# EAGLE board router (EAGLE 9.6.2), part 1 of 2
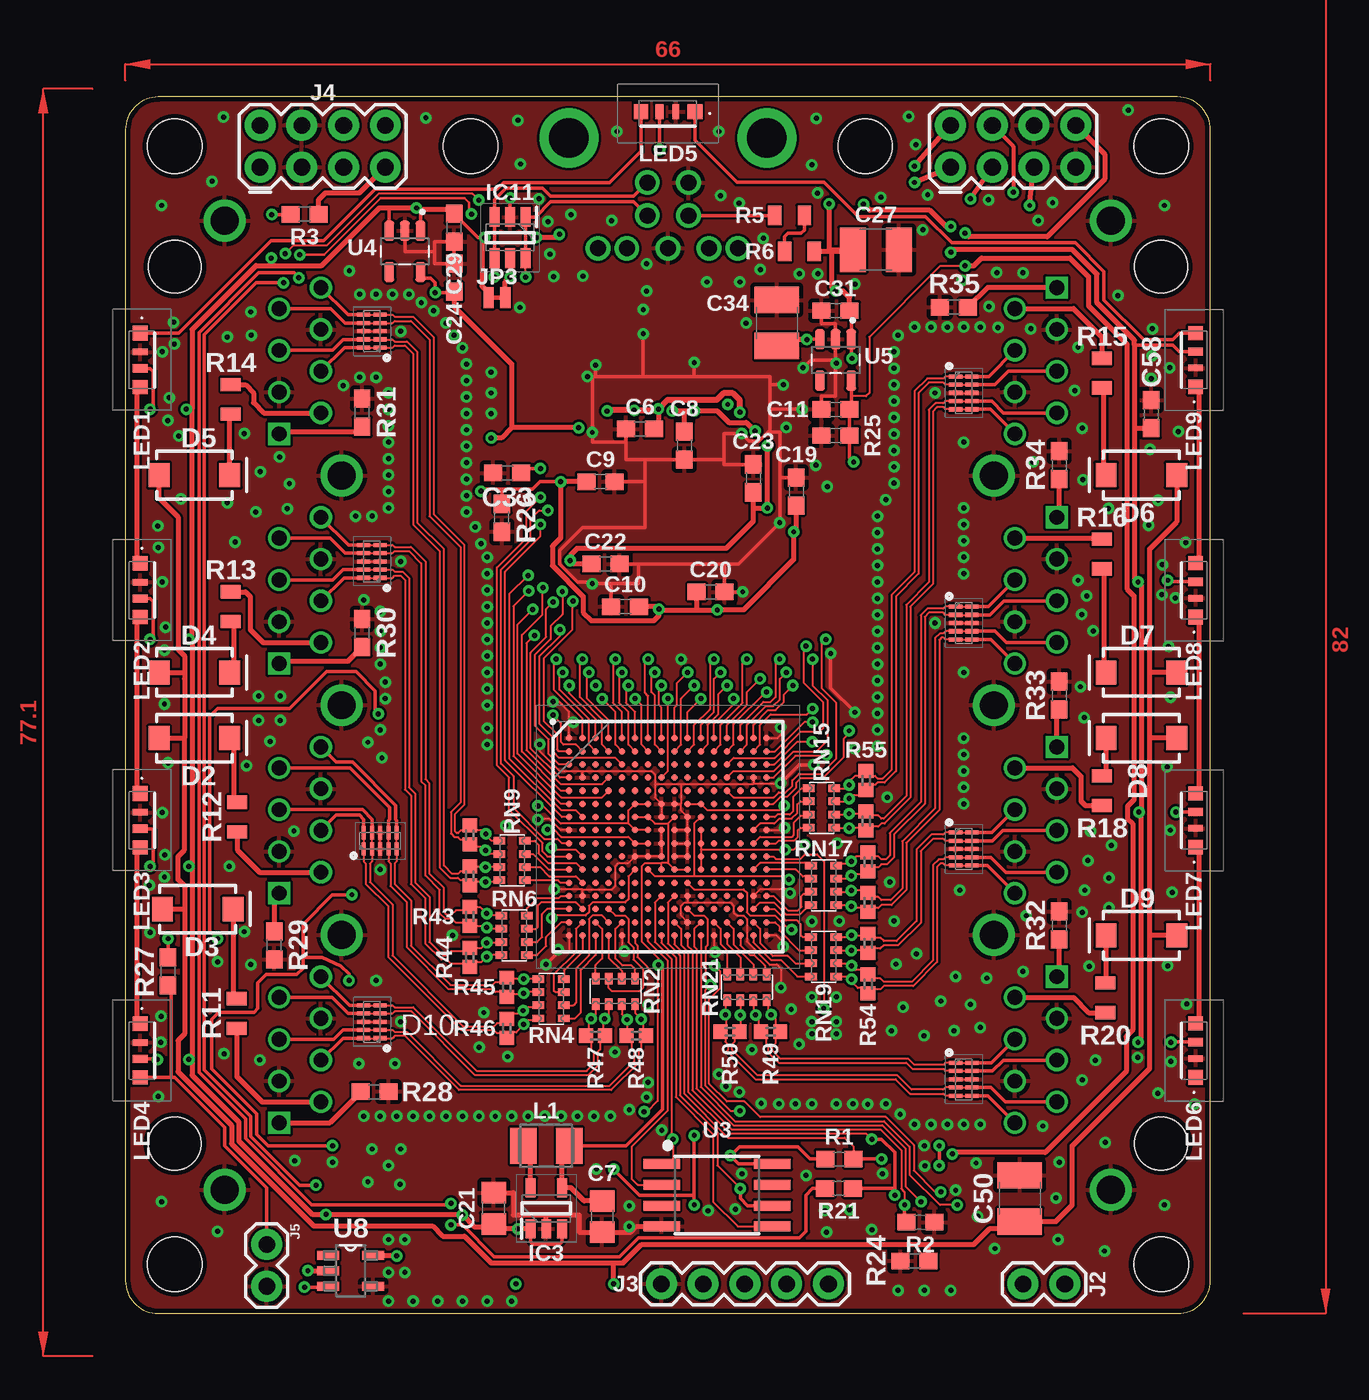
[diagram p3: board, top side]
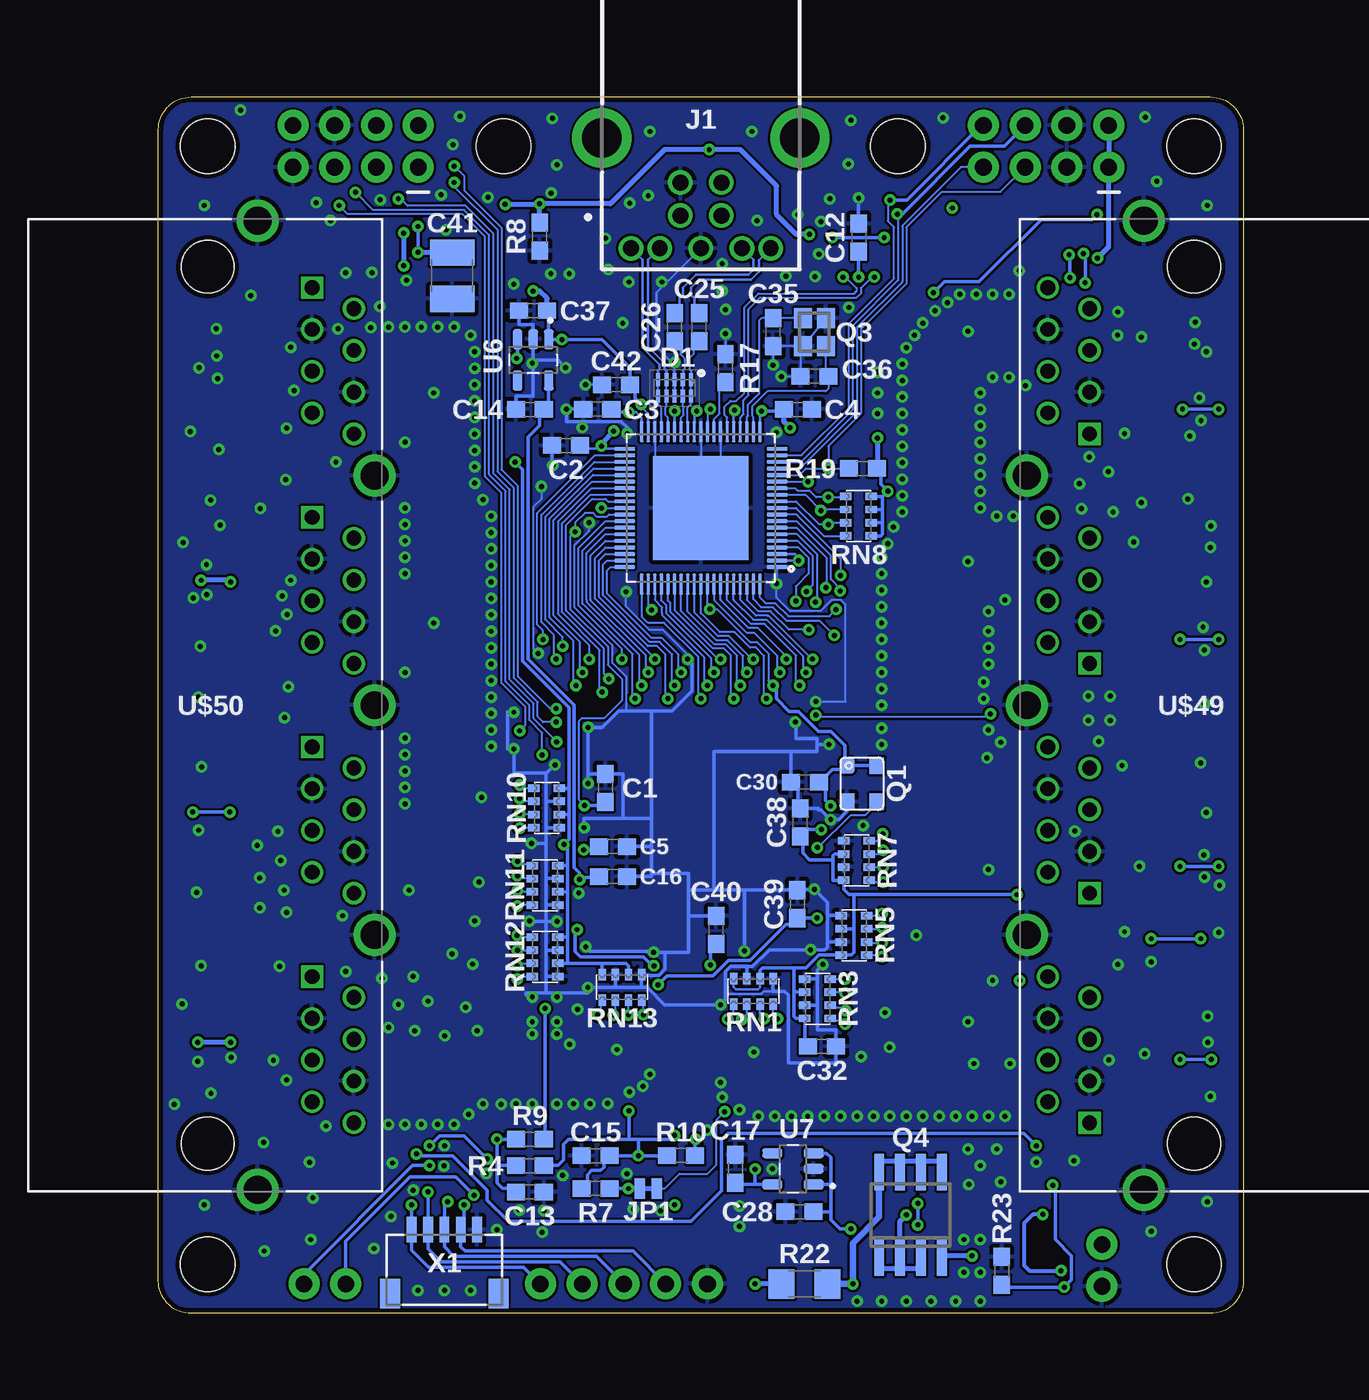
[diagram p4: board, bottom side, seen from below]

Size 66 x 74 mm. Coordinates in mm from the lower left corner, seen from the top.
Outline: 0,72 0,2 arc90 2,0 64,0 arc90 66,2 66,72 arc90 64,74 2,74 arc90 0,72
Copper layers (1*16): Top 0.035mm / dielectric 1.5mm / Bottom 0.035mm
Design rules "default *": minimum track width 0.125mm, minimum drill 0.3mm, track to track 0.125mm, track to pad 0.125mm, pad to pad 0.125mm, via to via 0.125mm, smd to smd 0mil, copper to edge 0.3mm, drill to drill 0.25mm, minimum pad ring 0.2mm, minimum via ring 0.2mm, stop-mask expansion 4mil, vias tented up to drill 4mm, thermal gap 10mil
Holes 3.3 mm at 3,71 63,71 63,3 3,3 45,71 21,71

## Footprints (pad centres in the part's own frame; a part is rotated, then mirrored left to right if it is on the bottom)
C0603 = smd 1.1 x 1: 1 -0.85,0; 2 0.85,0
0603 = smd 1.1 x 1: 1 -0.85,0; 2 0.85,0
C0805 = smd 1.3 x 1.5: 1 -0.95,0; 2 0.95,0
C1210 = smd 1.6 x 2.7: 1 -1.4,0; 2 1.4,0
SON50P100X250X80-10N = smd 0.8 x 0.25: 1 -0.5,1; 2 -0.5,0.5; 3 -0.5,0; 4 -0.5,-0.5; 5 -0.5,-1; 6 0.5,-1; 7 0.5,-0.5; 8 0.5,0; 9 0.5,0.5; 10 0.5,1
SMA-DIODE = smd 1.27 x 1.47: A -2.15,0; C 2.15,0
BGA256C80P16X16_1400X1400X170 = smd 0.41 x 0.41: A1 -6,6; A2 -5.2,6; A3 -4.4,6; A4 -3.6,6; A5 -2.8,6; A6 -2,6; A7 -1.2,6; A8 -0.4,6; A9 0.4,6; A10 1.2,6; A11 2,6; A12 2.8,6; A13 3.6,6; A14 4.4,6; A15 5.2,6; A16 6,6; B1 -6,5.2; B2 -5.2,5.2; B3 -4.4,5.2; B4 -3.6,5.2; B5 -2.8,5.2; B6 -2,5.2; B7 -1.2,5.2; B8 -0.4,5.2; B9 0.4,5.2; B10 1.2,5.2; B11 2,5.2; B12 2.8,5.2; B13 3.6,5.2; B14 4.4,5.2; B15 5.2,5.2; B16 6,5.2; C1 -6,4.4; C2 -5.2,4.4; C3 -4.4,4.4; C4 -3.6,4.4; C5 -2.8,4.4; C6 -2,4.4; C7 -1.2,4.4; C8 -0.4,4.4; C9 0.4,4.4; C10 1.2,4.4; C11 2,4.4; C12 2.8,4.4; C13 3.6,4.4; C14 4.4,4.4; C15 5.2,4.4; C16 6,4.4; D1 -6,3.6; D2 -5.2,3.6; D3 -4.4,3.6; D4 -3.6,3.6; D5 -2.8,3.6; D6 -2,3.6; D7 -1.2,3.6; D8 -0.4,3.6; D9 0.4,3.6; D10 1.2,3.6; D11 2,3.6; D12 2.8,3.6; D13 3.6,3.6; D14 4.4,3.6; D15 5.2,3.6; D16 6,3.6; E1 -6,2.8; E2 -5.2,2.8; E3 -4.4,2.8; E4 -3.6,2.8; E5 -2.8,2.8; E6 -2,2.8; E7 -1.2,2.8; E8 -0.4,2.8; E9 0.4,2.8; E10 1.2,2.8; E11 2,2.8; E12 2.8,2.8; E13 3.6,2.8; E14 4.4,2.8; E15 5.2,2.8; E16 6,2.8; F1 -6,2; F2 -5.2,2; F3 -4.4,2; F4 -3.6,2; F5 -2.8,2; F6 -2,2; F7 -1.2,2; F8 -0.4,2; F9 0.4,2; F10 1.2,2; F11 2,2; F12 2.8,2; F13 3.6,2; F14 4.4,2; F15 5.2,2; F16 6,2; G1 -6,1.2; G2 -5.2,1.2; G3 -4.4,1.2; G4 -3.6,1.2; G5 -2.8,1.2; G6 -2,1.2; G7 -1.2,1.2; G8 -0.4,1.2; G9 0.4,1.2; G10 1.2,1.2; G11 2,1.2; G12 2.8,1.2; G13 3.6,1.2; G14 4.4,1.2; G15 5.2,1.2; G16 6,1.2; H1 -6,0.4; H2 -5.2,0.4; H3 -4.4,0.4; H4 -3.6,0.4; H5 -2.8,0.4; H6 -2,0.4; H7 -1.2,0.4; H8 -0.4,0.4; H9 0.4,0.4; H10 1.2,0.4; H11 2,0.4; H12 2.8,0.4; H13 3.6,0.4; H14 4.4,0.4; H15 5.2,0.4; H16 6,0.4; J1 -6,-0.4; J2 -5.2,-0.4; J3 -4.4,-0.4; J4 -3.6,-0.4; J5 -2.8,-0.4; J6 -2,-0.4; J7 -1.2,-0.4; J8 -0.4,-0.4; J9 0.4,-0.4; J10 1.2,-0.4; J11 2,-0.4; J12 2.8,-0.4; J13 3.6,-0.4; J14 4.4,-0.4; J15 5.2,-0.4; J16 6,-0.4; K1 -6,-1.2; K2 -5.2,-1.2; K3 -4.4,-1.2; K4 -3.6,-1.2; K5 -2.8,-1.2; K6 -2,-1.2; K7 -1.2,-1.2; K8 -0.4,-1.2; K9 0.4,-1.2; K10 1.2,-1.2; K11 2,-1.2; K12 2.8,-1.2; K13 3.6,-1.2; K14 4.4,-1.2; K15 5.2,-1.2; K16 6,-1.2; L1 -6,-2; L2 -5.2,-2; L3 -4.4,-2; L4 -3.6,-2; L5 -2.8,-2; L6 -2,-2; L7 -1.2,-2; L8 -0.4,-2; L9 0.4,-2; L10 1.2,-2; L11 2,-2; L12 2.8,-2; L13 3.6,-2; L14 4.4,-2; L15 5.2,-2; L16 6,-2; M1 -6,-2.8; M2 -5.2,-2.8; M3 -4.4,-2.8; M4 -3.6,-2.8; M5 -2.8,-2.8; M6 -2,-2.8; M7 -1.2,-2.8; M8 -0.4,-2.8; M9 0.4,-2.8; M10 1.2,-2.8; M11 2,-2.8; M12 2.8,-2.8; M13 3.6,-2.8; M14 4.4,-2.8; M15 5.2,-2.8; M16 6,-2.8; N1 -6,-3.6; N2 -5.2,-3.6; N3 -4.4,-3.6; N4 -3.6,-3.6; N5 -2.8,-3.6; N6 -2,-3.6; N7 -1.2,-3.6; N8 -0.4,-3.6; N9 0.4,-3.6; N10 1.2,-3.6; N11 2,-3.6; N12 2.8,-3.6; N13 3.6,-3.6; N14 4.4,-3.6; N15 5.2,-3.6; N16 6,-3.6; P1 -6,-4.4; P2 -5.2,-4.4; P3 -4.4,-4.4; P4 -3.6,-4.4; P5 -2.8,-4.4; P6 -2,-4.4; P7 -1.2,-4.4; P8 -0.4,-4.4; P9 0.4,-4.4; P10 1.2,-4.4; P11 2,-4.4; P12 2.8,-4.4; P13 3.6,-4.4; P14 4.4,-4.4; P15 5.2,-4.4; P16 6,-4.4; R1 -6,-5.2; R2 -5.2,-5.2; R3 -4.4,-5.2; R4 -3.6,-5.2; R5 -2.8,-5.2; R6 -2,-5.2; R7 -1.2,-5.2; R8 -0.4,-5.2; R9 0.4,-5.2; R10 1.2,-5.2; R11 2,-5.2; R12 2.8,-5.2; R13 3.6,-5.2; R14 4.4,-5.2; R15 5.2,-5.2; R16 6,-5.2; T1 -6,-6; T2 -5.2,-6; T3 -4.4,-6; T4 -3.6,-6; T5 -2.8,-6; T6 -2,-6; T7 -1.2,-6; T8 -0.4,-6; T9 0.4,-6; T10 1.2,-6; T11 2,-6; T12 2.8,-6; T13 3.6,-6; T14 4.4,-6; T15 5.2,-6; T16 6,-6
SOT95P280X145-5N = smd 1.15 x 0.6: 1 -1.25,0.95; 2 -1.25,0; 3 -1.25,-0.95; 4 1.25,-0.95; 5 1.25,0.95
SOT95P280X145-6N = smd 1.2 x 0.6: 1 -1.25,0.95; 2 -1.25,0; 3 -1.25,-0.95; 4 1.25,-0.95; 5 1.25,0; 6 1.25,0.95
WR-COM_USB_TYPE_B = drill 0.97 pad 1.5: 1 1.25,4.71; 2 -1.25,4.71; 3 -1.25,2.71; 4 1.25,2.71; 5 -4.25,6.71; 6 -2.5,6.71; 7 0,6.71; 8 2.5,6.71; 9 4.25,6.71 | drill 2.4 pad 3.6: 10 6.02,0; 11 -6.02,0
1X02 = drill 1.016 pad 1.88: 1 0,0; 2 2.54,0
1X05 = drill 1.016 pad 1.88: 1 0,0; 2 2.54,0; 3 5.08,0; 4 7.62,0; 5 10.16,0
2X4 = drill 1.016 pad 1.88: 1 -3.81,-1.27; 2 -3.81,1.27; 3 -1.27,-1.27; 4 -1.27,1.27; 5 1.27,-1.27; 6 1.27,1.27; 7 3.81,-1.27; 8 3.81,1.27
SMT-JUMPER_2_NC_TRACE_NO-SILK = smd 0.635 x 1.27: 1 -0.508,0; 2 0.508,0
L3230M = smd 1.6 x 2.2: 1 -1.4,0; 2 1.4,0
SK6805SIDEG = smd 0.9 x 0.9: 1 -1.638,-0.1 | smd 0.4 x 0.9: 2 -0.488,-0.1 | smd 0.5 x 0.9: 3 0.512,-0.1 | smd 0.85 x 0.9: 4 1.637,-0.1
XO32 = smd 1 x 0.9: P$1 -1.1,-0.9; P$2 1.1,-0.9; P$3 1.1,0.9; P$4 -1.1,0.9
FA-20H = smd 1.2 x 1.1: 1 -0.85,-0.7; 2 0.85,-0.7; 3 0.85,0.7; 4 -0.85,0.7
SO-08 = smd 0.6 x 2.2: 1 -1.905,-2.6; 2 -0.635,-2.6; 3 0.635,-2.6; 4 1.905,-2.6; 5 1.905,2.6; 6 0.635,2.6; 7 -0.635,2.6; 8 -1.905,2.6
0805 = smd 0.8 x 1.2: 1 -0.9,0; 2 0.9,0
1206 = smd 1.6 x 1.8: 1 -1.4,0; 2 1.4,0
0402 = smd 0.85 x 0.9: 1 -0.58,0; 2 0.58,0
EXBV8V = smd 0.45 x 0.7: 1 -1.2,-0.775; 2 -0.4,-0.775; 3 0.4,-0.775; 4 1.2,-0.775; 5 1.2,0.775; 6 0.4,0.775; 7 -0.4,0.775; 8 -1.2,0.775
QFN40P900X900X100-77N-MOD = smd 1.26 x 0.22: 1 -4.635,3.6; 2 -4.635,3.2; 3 -4.635,2.8; 4 -4.635,2.4; 5 -4.635,2; 6 -4.635,1.6; 7 -4.635,1.2; 8 -4.635,0.8; 9 -4.635,0.4; 10 -4.635,0; 11 -4.635,-0.4; 12 -4.635,-0.8; 13 -4.635,-1.2; 14 -4.635,-1.6; 15 -4.635,-2; 16 -4.635,-2.4; 17 -4.635,-2.8; 18 -4.635,-3.2; 19 -4.635,-3.6; 39 4.635,-3.6; 40 4.635,-3.2; 41 4.635,-2.8; 42 4.635,-2.4; 43 4.635,-2; 44 4.635,-1.6; 45 4.635,-1.2; 46 4.635,-0.8; 47 4.635,-0.4; 48 4.635,0; 49 4.635,0.4; 50 4.635,0.8; 51 4.635,1.2; 52 4.635,1.6; 53 4.635,2; 54 4.635,2.4; 55 4.635,2.8; 56 4.635,3.2; 57 4.635,3.6 | smd 0.22 x 1.26: 20 -3.6,-4.635; 21 -3.2,-4.635; 22 -2.8,-4.635; 23 -2.4,-4.635; 24 -2,-4.635; 25 -1.6,-4.635; 26 -1.2,-4.635; 27 -0.8,-4.635; 28 -0.4,-4.635; 29 0,-4.635; 30 0.4,-4.635; 31 0.8,-4.635; 32 1.2,-4.635; 33 1.6,-4.635; 34 2,-4.635; 35 2.4,-4.635; 36 2.8,-4.635; 37 3.2,-4.635; 38 3.6,-4.635; 58 3.6,4.635; 59 3.2,4.635; 60 2.8,4.635; 61 2.4,4.635; 62 2,4.635; 63 1.6,4.635; 64 1.2,4.635; 65 0.8,4.635; 66 0.4,4.635; 67 0,4.635; 68 -0.4,4.635; 69 -0.8,4.635; 70 -1.2,4.635; 71 -1.6,4.635; 72 -2,4.635; 73 -2.4,4.635; 74 -2.8,4.635; 75 -3.2,4.635; 76 -3.6,4.635 | smd 5.81 x 6.31: 77 0,0
SO08-EIAJ = smd 0.61 x 2.21: 1 -1.905,-3.378; 2 -0.635,-3.378; 3 0.635,-3.378; 4 1.905,-3.378; 5 1.905,3.353; 6 0.635,3.353; 7 -0.635,3.353; 8 -1.905,3.353
SOT95P280X145-5N' = smd 1.21 x 0.59: 1 -1.255,0.95; 2 -1.255,0; 3 -1.255,-0.95; 4 1.255,-0.95; 5 1.255,0.95
SOT95P270X145-5N = smd 1.321 x 0.559: 1 -1.372,0.94; 2 -1.372,0; 3 -1.372,-0.94; 4 1.372,-0.94; 5 1.372,0.94
ARJ14A-MESA-MU2_CONN_ARJ14A-MESA-MU2 = drill 0.9 square: A1 -25.4,6.35; B1 -11.43,6.35; C1 2.54,6.35; D1 16.51,6.35 | drill 0.9: A2 -24.13,8.89; A3 -22.86,6.35; A4 -21.59,8.89; A5 -20.32,6.35; A6 -19.05,8.89; A7 -17.78,6.35; A8 -16.51,8.89; B2 -10.16,8.89; B3 -8.89,6.35; B4 -7.62,8.89; B5 -6.35,6.35; B6 -5.08,8.89; B7 -3.81,6.35; B8 -2.54,8.89; C2 3.81,8.89; C3 5.08,6.35; C4 6.35,8.89; C5 7.62,6.35; C6 8.89,8.89; C7 10.16,6.35; C8 11.43,8.89; D2 17.78,8.89; D3 19.05,6.35; D4 20.32,8.89; D5 21.59,6.35; D6 22.86,8.89; D7 24.13,6.35; D8 25.4,8.89 | drill 1.7: S1 -29.465,3.05; S2 29.465,3.05; S3 13.97,10.16; S4 0,10.16; S5 -13.97,10.16 | hole 3.2: 26.67,0; -26.67,0
SM05B-SRSS-TB = smd 0.6 x 1.55: 1 2,0; 2 1,0; 3 0,0; 4 -1,0; 5 -2,0 | smd 1.2 x 1.8: M1 3.3,3.875; M2 -3.3,3.875

## Placement (x,y rotation side)
C1  [C0603]  38.8,31.98 90 bottom
C2  0.1uF  [0603]  41.2,52.8 0 bottom
C3  0.1uF  [0603]  39.3,55 0 bottom
C4  0.1uF  [0603]  27.1,55 180 bottom
C5  0.1uF  [0603]  38.35,28.4 0 bottom
C6  0.1uF  [0603]  31.3,53.8 0 top
C7  [C0805]  29,5.9 270 top
C8  0.1uF  [0603]  34,52.8 90 top
C9  0.1uF  [0603]  28.9,50.6 180 top
C10  0.1uF  [0603]  30.4,43 0 top
C11  0.1uF  [0603]  43.2,55 180 top
C12  0.1uF  [0603]  23.4,65.45 270 bottom
C13  0.1uF  [0603]  43.4,7.4 0 bottom
C14  0.1uF  [0603]  43.4,55 180 bottom
C15  0.1uF  [0603]  39.4,9.6 180 bottom
C16  0.1uF  [0603]  38.35,26.57 0 bottom
C17  0.1uF  [0603]  30.9,8.8 90 bottom
C19  0.1uF  [0603]  40.8,50 270 top
C20  0.1uF  [0603]  35.6,43.9 180 top
C21  [C0805]  22.4,6.4 90 top
C22  0.1uF  [0603]  29.2,45.6 180 top
C23  0.1uF  [0603]  38.2,50.8 270 top
C24  4.7uF  [C0603]  20,63 270 top
C25  0.1uF  [0603]  33.1,60 90 bottom
C26  0.1uF  [0603]  34.6,60 90 bottom
C27  100uF  [C1210]  45.65,64.7 0 top
C28  0.1uF  [0603]  27,6.2 180 bottom
C29  4.7uF  [C0603]  20,66.05 90 top
C30  0.1uF  [0603]  26.67,32.33 0 bottom
C31  0.1uF  [0603]  43.2,61 180 top
C32  0.1uF  [0603]  25.62,16.25 0 bottom
C33  0.1uF  [0603]  23.23,51.12 0 top
C34  100uF  [C1210]  39.62,60.25 90 top
C35  0.1uF  [0603]  28.6,59.7 90 bottom
C36  0.1uF  [0603]  26.1,57 0 bottom
C37  0.1uF  [0603]  43.2,61 180 bottom
C38  0.1uF  [0603]  26.95,29.88 90 bottom
C39  0.1uF  [0603]  27.12,24.9 90 bottom
C40  0.1uF  [0603]  32.08,23.32 90 bottom
C41  100uF  [C1210]  48.12,63.12 270 bottom
C42  0.1uF  [0603]  38.15,56.5 180 bottom
C50  100uF  [C1210]  54.4,7 90 top
C58  0.1uF  [0603]  62.4,54.7 90 top
D1  PESD4USB5U-TBSX  [SON50P100X250X80-10N]  34.6,56.3 270 bottom
D2  1A/40V/500mV  [SMA-DIODE]  4.2,35 0 top
D3  1A/40V/500mV  [SMA-DIODE]  4.4,24.6 0 top
D4  1A/40V/500mV  [SMA-DIODE]  4.2,39 0 top
D5  1A/40V/500mV  [SMA-DIODE]  4.2,51 0 top
D6  1A/40V/500mV  [SMA-DIODE]  61.8,51 180 top
D7  1A/40V/500mV  [SMA-DIODE]  61.8,39 180 top
D8  1A/40V/500mV  [SMA-DIODE]  61.8,35 180 top
D9  1A/40V/500mV  [SMA-DIODE]  61.8,23 180 top
D10  PESD4USB5U-TBSX  [SON50P100X250X80-10N]  15,17.75 180 top
D11  PESD4USB5U-TBSX  [SON50P100X250X80-10N]  15.5,28.75 90 top
D12  PESD4USB5U-TBSX  [SON50P100X250X80-10N]  15,45.75 180 top
D13  PESD4USB5U-TBSX  [SON50P100X250X80-10N]  15,59.75 180 top
D14  PESD4USB5U-TBSX  [SON50P100X250X80-10N]  51,56 0 top
D15  PESD4USB5U-TBSX  [SON50P100X250X80-10N]  51,42 0 top
D16  PESD4USB5U-TBSX  [SON50P100X250X80-10N]  51,28.25 0 top
D17  PESD4USB5U-TBSX  [SON50P100X250X80-10N]  51,14.25 0 top
IC1  LFE5U-12F-6BG256C  [BGA256C80P16X16_1400X1400X170]  33,29 0 top
IC3  SC189CSKTRT  [SOT95P280X145-5N]  25.6,6.4 90 top
IC11  USBLC6-2SC6  [SOT95P280X145-6N]  23.4,65.45 270 top
J1  692221030100  [WR-COM_USB_TYPE_B]  33,71.5 180 bottom
J2  [1X02]  54.6,1.8 0 top
J3  [1X05]  32.6,1.8 0 top
J4  [2X4]  12,71 0 top
J5  [1X02]  8.6,4.2 270 top
J8  [2X4]  54,71 0 top
JP1  JUMPER-SMT_2_NC_TRACE_NO-SILK  [SMT-JUMPER_2_NC_TRACE_NO-SILK]  36.2,7.6 0 bottom
JP3  JUMPER-SMT_2_NC_TRACE_NO-SILK  [SMT-JUMPER_2_NC_TRACE_NO-SILK]  22.6,61.8 180 top
L1  [L3230M]  25.6,10.2 180 top
LED1  SK6805_SIDE-G  [SK6805SIDEG]  1,58 270 top
LED2  SK6805_SIDE-G  [SK6805SIDEG]  1,44 270 top
LED3  SK6805_SIDE-G  [SK6805SIDEG]  1,30 270 top
LED4  SK6805_SIDE-G  [SK6805SIDEG]  1,16 270 top
LED5  SK6805_SIDE-G  [SK6805SIDEG]  33,73 180 top
LED6  SK6805_SIDE-G  [SK6805SIDEG]  65,16 90 top
LED7  SK6805_SIDE-G  [SK6805SIDEG]  65,30 90 top
LED8  SK6805_SIDE-G  [SK6805SIDEG]  65,44 90 top
LED9  SK6805_SIDE-G  [SK6805SIDEG]  65,58 90 top
Q1  CRYSTALRESONATORXO32  [XO32]  23.2,32.23 270 bottom
Q3  FA-20H  [FA-20H]  26.1,59.7 90 bottom
Q4  [SO-08]  20.25,6 0 bottom
R1  [0603]  43.42,9.4 180 top
R2  [0603]  48.35,5.55 180 top
R3  [0603]  10.9,66.85 0 top
R4  [0603]  43.4,9 180 bottom
R5  [0805]  40.4,66.8 180 top
R6  [0805]  41,64.6 180 top
R7  [0603]  39.4,7.6 0 bottom
R8  [0603]  42.8,65.5 90 bottom
R9  [0603]  43.4,10.6 180 bottom
R10  [0603]  34.2,9.6 0 bottom
R11  [0805]  6.78,18.25 270 top
R12  [0805]  6.8,30.2 270 top
R13  [0805]  6.4,43 90 top
R14  [0805]  6.4,55.6 90 top
R15  [0805]  59.4,57.2 90 top
R16  [0805]  59.4,46.2 90 top
R17  [0603]  31.5,57.5 270 bottom
R18  [0805]  59.4,31.8 270 top
R19  [0603]  23.15,51.4 180 bottom
R20  [0805]  59.6,19.2 270 top
R21  [0603]  43.4,7.6 0 top
R22  [1206]  26.7,1.8 0 bottom
R23  [0603]  14.7,2.6 270 bottom
R24  [0603]  48,3.2 0 top
R25  [0603]  43.2,53.4 0 top
R26  [0603]  22.9,48.4 90 top
R27  [0603]  2.6,20.8 270 top
R28  [0603]  15.15,13.5 180 top
R29  [0603]  9.05,22.4 90 top
R30  [0603]  14.4,41.4 270 top
R31  [0603]  14.4,54.8 270 top
R32  [0603]  56.8,23.6 270 top
R33  [0603]  56.8,37.6 270 top
R34  [0603]  56.8,51.6 270 top
R35  [0603]  50.4,61.2 0 top
R41  [0402]  20.95,26.62 270 top
R42  [0402]  20.95,29.1 90 top
R43  [0402]  20.95,24.15 90 top
R44  [0402]  20.95,21.65 270 top
R45  [0402]  23.2,19.85 90 top
R46  [0402]  23.2,17.35 270 top
R47  [0402]  28.6,16.9 180 top
R48  [0402]  31.08,16.9 180 top
R49  [0402]  39.25,17.15 180 top
R50  [0402]  36.77,17.15 0 top
R51  [0402]  45.17,27.48 270 top
R52  [0402]  45.17,25 90 top
R53  [0402]  45.17,22.52 270 top
R54  [0402]  45.17,20.05 90 top
R55  [0402]  45.05,32.42 270 top
R56  [0402]  45.05,29.95 90 top
RN1  [EXBV8V]  29.8,19.6 180 bottom
RN2  [EXBV8V]  29.8,19.6 180 top
RN3  [EXBV8V]  25.9,19.15 270 bottom
RN4  [EXBV8V]  25.9,19.15 90 top
RN5  [EXBV8V]  23.68,23 270 bottom
RN6  [EXBV8V]  23.65,23 90 top
RN7  [EXBV8V]  23.52,27.55 270 bottom
RN8  [EXBV8V]  23.4,48.5 270 bottom
RN9  [EXBV8V]  23.52,27.55 90 top
RN10  [EXBV8V]  42.38,30.75 90 bottom
RN11  [EXBV8V]  42.48,26.05 90 bottom
RN12  [EXBV8V]  42.48,21.7 90 bottom
RN13  [EXBV8V]  37.8,19.85 180 bottom
RN15  [EXBV8V]  42.35,30.75 270 top
RN17  [EXBV8V]  42.48,26.05 270 top
RN19  [EXBV8V]  42.48,21.7 270 top
RN21  [EXBV8V]  37.8,19.85 180 top
U1  FT601Q-B-T-MOD  [QFN40P900X900X100-77N-MOD]  33,49 180 bottom
U3  25F32006WSOI  [SO08-EIAJ]  36,7.2 270 top
U4  TLV73333PDBVR  [SOT95P280X145-5N']  17,64.6 270 top
U5  LP2985AIM5-2.5  [SOT95P280X145-5N']  43.2,58 270 top
U6  LP2985AIM5-2.5  [SOT95P280X145-5N']  43.2,58 270 bottom
U7  LP2985AIM5-2.5  [SOT95P280X145-5N']  27.4,8.8 180 bottom
U8  MCP1415T-E/OT  [SOT95P270X145-5N]  13.7,2.6 0 top
U$49  QUADRJ45  [ARJ14A-MESA-MU2_CONN_ARJ14A-MESA-MU2]  3,37 90 bottom
U$50  QUADRJ45  [ARJ14A-MESA-MU2_CONN_ARJ14A-MESA-MU2]  63,37 270 bottom
X1  SM05B-SRSS-TB  [SM05B-SRSS-TB]  48.6,5.1 180 bottom

## Tracks (layer width: path | path; a pad name or v marks a point on that pad's centre or on a via)
1V2  (via drill 0.3)
  Top 0.125: IC1.G6 IC1.G7 32.2,29.8 33,29.8 | 33,27.4 32.6,27.4 | 33,27.4 IC1.L9 IC1.L10 | IC1.G9 33,29.8 | 33,29.8 33,27.4 | IC1.L8 32.6,27.4 | 32.6,27.4 31.6,27.4 31.4,27.2 31.4,22.62 32.42,21.6 v32.42,21.2
  Top 0.2: v32.42,21.2 32.67,20.95 32.67,12.43 30.44,10.2 L1.1
  Top 0.3: L1.1 26.55,10.2 IC3.4 27.1,7.65 27.9,6.85 C7.1
  Bottom 0.2: C40.1 32.4,22.15 32.4,21.23 v32.42,21.2
BE0  (via drill 0.3)
  Top 0.125: IC1.B1 26.38,34.2 26.25,34.33 26.25,35.25 25.45,36.05 25.45,39.85 27.17,41.58 27.17,43.27 v27.23,43.33
  Bottom 0.125: U1.4 27.08,46.6 26.45,45.98 26.45,45 27.23,44.23 v27.23,43.33
BE1  (via drill 0.3)
  Top 0.125: IC1.C1 26.38,33.4 25.75,34.02 25.75,34.92 24.9,35.77 24.9,40.05 25.88,41.02 25.88,41.83 26.58,42.52 v26.58,43.92
  Bottom 0.125: U1.5 27.1,47 26.2,46.1 26.2,44.3 v26.58,43.92
BE2  (via drill 0.3)
  Top 0.125: IC1.D1 26.42,32.6 24.65,34.38 24.65,40.2 25.6,41.15 25.6,42.85 v26.02,43.27
  Bottom 0.125: U1.6 27.15,47.4 25.95,46.2 25.95,43.35 v26.02,43.27
BE3  (via drill 0.3)
  Top 0.125: IC1.E1 26.5,31.8 24.12,34.17 24.12,41.27 25.35,42.5 25.35,44.1 v25.4,44.15
  Bottom 0.125: U1.7 27.17,47.8 25.35,45.98 25.35,44.2 v25.4,44.15
CLK  (via drill 0.3)
  Top 0.125: IC1.D8 33,33 v33,37.4
  Bottom 0.125: U1.58 36.6,42.4 36.2,42 35.23,42 33.15,39.92 33.15,37.55 v33,37.4
D0  (via drill 0.3)
  Top 0.125: IC1.E13 37,31.4 39.45,31.4 39.75,31.7 40.16,31.7 40.56,32.1 40.56,32.42 40.96,32.83 42.33,32.83 43.25,33.75 43.25,37.15 42.35,38.05 42.35,40.75 v42.6,41
  Bottom 0.125: U1.40 39.43,52.2 42.95,48.68 42.95,41.9 42.6,41.55 v42.6,41
D1  (via drill 0.3)
  Top 0.125: IC1.D13 37,33 39.45,33 40.62,34.17 42.02,34.17 42.73,34.88 42.73,37.27 41.8,38.2 v41.8,39.8
  Bottom 0.125: U1.41 39.48,51.8 42.7,48.58 42.7,42.05 41.95,41.3 41.95,39.95 v41.8,39.8
D2  (via drill 0.3)
  Top 0.125: IC1.C13 37,33.8 39.5,33.8 41.08,35.38 42.2,35.38 42.45,35.62 42.45,37.17 41.25,38.37 41.25,40.45 v41.4,40.6
  Bottom 0.125: U1.42 39.52,51.4 42.45,48.47 42.45,42.2 41.4,41.15 v41.4,40.6
D3  (via drill 0.3)
  Top 0.125: IC1.A15 38.2,35.8 39.1,36.7 39.55,36.7 40.05,37.2 40.05,37.65 v40.6,38.2
  Bottom 0.125: U1.43 39.57,51 42.2,48.37 42.2,42.34 40.75,40.89 40.75,38.35 v40.6,38.2
D4  (via drill 0.3)
  Top 0.125: IC1.B14 37.8,34.6 37.8,35.8 38.95,36.95 39.4,36.95 39.8,37.35 39.8,38.6 v40.2,39
  Bottom 0.125: U1.44 39.61,50.6 41.95,48.26 41.95,42.45 40.35,40.85 40.35,39.15 v40.2,39
D5  (via drill 0.3)
  Top 0.125: IC1.A14 37.4,35.8 38.8,37.2 39.25,37.2 39.55,37.5 39.55,39.55 v39.8,39.8
  Bottom 0.125: U1.45 39.66,50.2 41.7,48.16 41.7,42.55 39.8,40.65 v39.8,39.8
D6  (via drill 0.3)
  Top 0.125: IC1.B13 37,34.6 37,35.85 38.95,37.8 v39,37.8
  Bottom 0.125: U1.46 39.71,49.8 41.45,48.06 41.45,42.65 39.15,40.35 39.15,37.95 v39,37.8
D7  (via drill 0.3)
  Top 0.125: IC1.A13 36.6,35.8 37.8,37 37.8,37.8 v38.6,38.6
  Bottom 0.125: U1.47 38.63,49.4 38.78,49.55 39.6,49.55 41.2,47.95 41.2,42.76 38.9,40.46 38.9,38.9 v38.6,38.6
D8  (via drill 0.3)
  Top 0.125: IC1.B12 36.2,34.6 36.2,35.8 37.4,37 37.55,37.15 37.55,39.55 v37.8,39.8
  Bottom 0.125: U1.50 38.8,48.2 40.45,46.55 40.45,43.07 37.8,40.42 v37.8,39.8
D9  (via drill 0.3)
  Top 0.125: IC1.A12 35.8,35.8 35.8,35.85 37,37.05 v37,37.4
  Bottom 0.125: U1.51 38.8,47.8 40.2,46.4 40.2,43.17 37.15,40.12 37.15,37.55 v37,37.4
D10  (via drill 0.3)
  Top 0.125: IC1.B11 35.4,34.6 35.4,35.8 36.05,36.45 36.05,37.65 v36.6,38.2
  Bottom 0.125: U1.52 38.8,47.4 39.95,46.25 39.95,43.4 39.95,43.27 36.75,40.08 36.75,38.35 v36.6,38.2
D11  (via drill 0.3)
  Top 0.125: IC1.A11 35,35.8 35.8,36.6 35.8,38.6 v36.2,39
  Bottom 0.125: U1.53 38.8,47 39.7,46.1 39.7,43.4 39.7,43.38 36.35,40.03 36.35,39.15 v36.2,39
D12  (via drill 0.3)
  Top 0.125: IC1.B10 34.6,34.6 34.6,35.8 35.55,36.75 35.55,39.55 v35.8,39.8
  Bottom 0.125: U1.54 38.8,46.6 39.45,45.95 39.45,43.48 35.8,39.83 v35.8,39.8
D13  (via drill 0.3)
  Top 0.125: v35,37.4 34.2,36.6 IC1.A10
  Bottom 0.125: U1.55 38.8,46.2 39.2,45.8 39.2,43.59 36.21,40.6 35.66,40.6 35.15,40.09 35.15,37.55 v35,37.4
D14  (via drill 0.3)
  Top 0.125: IC1.B9 33.8,34.6 33.8,37.4 v34.6,38.2
  Bottom 0.125: U1.56 38.7,45.8 38.95,45.55 38.95,43.69 36.11,40.85 35.5,40.85 34.75,40.1 34.75,38.35 v34.6,38.2
D15  (via drill 0.3)
  Top 0.125: v34.2,39 33.55,38.35 33.55,37 33.4,36.85 IC1.A9
  Bottom 0.125: U1.57 38.5,45.4 38.7,45.2 38.7,43.79 36.01,41.1 35.38,41.1 34.35,40.08 34.35,39.15 v34.2,39
D16  (via drill 0.3)
  Top 0.125: v32.6,38.2 32.45,38.05 32.45,37.02 32.6,36.88 IC1.A8
  Bottom 0.125: U1.60 35.8,43.4 35.35,42.95 35.35,42.6 35.35,42.48 32.8,39.92 32.8,38.4 v32.6,38.2
D17  (via drill 0.3)
  Top 0.125: IC1.B8 32.2,34.6 32.2,37.59 31.99,37.8 31.99,38.79 v32.2,39
  Bottom 0.125: U1.61 35.4,43.37 35.1,43.06 35.1,42.58 32.39,39.87 32.39,39.19 v32.2,39
D18  (via drill 0.3)
  Top 0.125: IC1.A7 31.8,37.56 31.6,37.76 31.6,39.6 v31.8,39.8
  Bottom 0.125: U1.62 35,43.37 34.85,43.22 34.85,42.68 31.97,39.8 v31.8,39.8
D19  (via drill 0.3)
  Top 0.125: IC1.B7 31.4,34.6 31.4,37 v31,37.4
  Bottom 0.125: U1.63 34.6,42.79 32.26,40.45 31.6,40.45 31.17,40.02 31.17,37.58 v31,37.4
D20  (via drill 0.3)
  Top 0.125: IC1.A6 31,36.6 30.45,37.15 30.45,38.05 v30.6,38.2
  Bottom 0.125: U1.64 34.2,42.74 32.16,40.7 31.48,40.7 30.8,40.02 30.8,38.4 v30.6,38.2
D21  (via drill 0.3)
  Top 0.125: IC1.B6 30.6,34.6 30.6,36.58 30.02,37.15 30.02,38.83 v30.2,39
  Bottom 0.125: U1.65 33.8,42.69 32.06,40.95 31.38,40.95 30.42,40 30.42,39.23 v30.2,39
D22  (via drill 0.3)
  Top 0.125: IC1.A5 30.2,36.6 29.65,37.15 29.65,39.65 v29.8,39.8
  Bottom 0.125: U1.66 33.4,42.65 31.95,41.2 31.27,41.2 29.88,39.8 v29.8,39.8
D23  (via drill 0.3)
  Top 0.125: IC1.B5 29.8,34.6 29.8,36.6 v29,37.4
  Bottom 0.125: U1.67 33,42.6 31.85,41.45 30.96,41.45 30.01,40.5 29.65,40.5 29.15,40 29.15,37.55 v29,37.4
D24  (via drill 0.3)
  Top 0.125: IC1.A4 29.4,36.09 28.05,37.44 28.05,38.85 v28.2,39
  Bottom 0.125: U1.69 32.2,43.4 30.2,41.4 29.75,41.4 28.35,40 28.35,39.15 v28.2,39
D25  (via drill 0.3)
  Top 0.125: IC1.B4 29,34.6 29,36.14 27.65,37.49 27.65,39.65 v27.8,39.8
  Bottom 0.125: U1.70 31.8,43.4 30.1,41.7 29.52,41.7 27.8,39.98 v27.8,39.8
D26  (via drill 0.3)
  Top 0.125: v27,38.2 27,37.75 28.6,36.15 IC1.A3
  Bottom 0.125: U1.71 31.4,43.4 29.95,41.95 29.12,41.95 27.2,40.03 27.2,38.4 v27,38.2
D27  (via drill 0.3)
  Top 0.125: IC1.B3 28.2,34.6 28.2,36.15 26.4,37.95 26.4,38.8 v26.6,39
  Bottom 0.125: U1.72 31,43.4 29.8,42.2 29.01,42.2 26.8,39.99 26.8,39.2 v26.6,39
D28  (via drill 0.3)
  Top 0.125: IC1.A2 27.8,36.2 26.05,37.95 26.05,39.65 v26.2,39.8
  Bottom 0.125: U1.73 30.6,43.4 29.65,42.45 28.95,42.45 28.91,42.45 28.9,42.45 26.25,39.8 v26.2,39.8
D29  (via drill 0.3)
  Top 0.125: IC1.C5 29.8,33.8 26.38,33.8 26,34.17 26,35.05 25.17,35.88 25.17,39.95 26.42,41.2 v26.42,41.6
  Bottom 0.125: U1.74 30.2,43.4 29.5,42.7 28.75,42.7 27.65,41.6 v26.42,41.6
D30  (via drill 0.3)
  Top 0.125: IC1.D4 29,32.2 26.47,32.2 24.4,34.27 24.4,40.77 v24.88,41.25
  Bottom 0.125: U1.75 29.8,43.45 29.3,42.95 28.6,42.95 27.8,42.15 25.77,42.15 v24.88,41.25
D31  (via drill 0.3)
  Top 0.125: IC1.E4 29,31.4 26.5,31.4 23.85,34.05 23.85,41.9 v24.77,42.83
  Bottom 0.125: U1.76 29.4,43.55 29.05,43.2 28.45,43.2 27.67,42.42 25.17,42.42 v24.77,42.83
D+  (via drill 0.3)
  Top 0.125: v22.45,63.05 IC11.4
  Top 0.2: J1.3 30.91,67.95 25.88,67.95 25.38,68.45 23.15,68.45 22.45,67.75 IC11.3 IC11.4
  Bottom 0.125: U1.23 30.6,54.5 30.4,54.7 30.4,55.55 30.1,55.85 30.1,61.1 29.4,61.8 23.52,61.8 23.27,62.05 23.27,62.38 22.6,63.05 v22.45,63.05
D-  (via drill 0.3)
  Top 0.125: v24.35,63.05 IC11.6
  Top 0.2: J1.2 30.91,67.62 25.88,67.62 24.95,66.7 IC11.1 IC11.6
  Bottom 0.125: U1.25 31.4,54.5 31.55,54.65 31.55,55.15 31.2,55.5 30.85,55.5 30.35,56 30.35,61.2 29.5,62.05 23.65,62.05 23.52,62.17 23.52,62.38 24.2,63.05 v24.35,63.05
FT6V10  (via drill 0.3)
  Top 0.3: 34,54.9 v34.6,54.9 36,54.9 36.7,54.2 37.77,54.2 v38.3,53.67 | 34,54.9 v33.25,54.9 | C8.2 34,54.9 | 38.2,49 v39.05,49 v39.05,52.77 | C22.2 27.25,45.6 v27.05,45.8 27.05,46.1 27.5,46.55 36.55,46.55 38.2,48.2 38.2,49 | 38.2,49 C23.2
  Bottom 0.125: 27.05,45.98 v27.05,45.8 | v39.05,49 U1.48 | v39.05,52.77 39.05,52.6 38.8,52.6
  Bottom 0.15: v33.25,54.9 33.4,54.75 U1.30 | U1.2 v27.05,45.8 | U1.3 27.27,46.2 27.05,45.98 | U1.33 v34.6,54.9 | U1.39 38.8,52.6 40.35,52.6 C2.2
  Bottom 0.3: v38.3,53.67 39.05,52.92 v39.05,52.77
FT6VREF
  Bottom 0.125: U1.27 32.2,54.41 31.86,54.75 31.86,56.29 R17.2
GND  (via drill 0.3)
  Top 0.125: IC1.J10 IC1.K10 IC1.K9 | IC1.J10 IC1.H10 | IC1.H10 IC1.G10 33.8,30.6 33.8,31 | IC1.H10 IC1.H9 | IC1.J9 IC1.J10 | v40.1,29.55 40.1,29.4 IC1.H16 | IC1.T16 39.6,23 40,22.6 v40,22.3 | IC1.H1 26.48,29.4 25.8,30.08 25.12,30.08 v25.1,30.05 | IC1.A16 39.67,35 39.85,35.17 v39.85,35.65 | IC1.T1 27,22 26.45,22 v26.33,22.12 | IC1.H8 IC1.J8 IC1.K8 IC1.K7 IC1.K6 30.6,27.4 30,27.4 29.8,27.2 29.8,26 29.6,25.8 27.8,25.8 | IC1.G8 IC1.F8 32.2,31.4 32.2,32.2 | IC1.D2 27.8,33 | 27.8,33 26.42,33 25.2,34.22 v25.2,34.62 25.2,34.48 | 27.8,33 32,33 32.2,32.8 32.2,32.2 | 33.8,32.2 38.2,32.2 | IC1.D15 38.2,32.2 | v39.85,32.25 39.8,32.2 38.2,32.2 | IC1.N2 27.8,25.8 | 33.8,32.2 33.8,31 | IC1.F9 33.8,31 | 32.2,32.2 33.8,32.2 | IC1.T5 30.2,22.05 v30.35,22.05 | IC1.N15 38.6,25.8 40.2,25.8 v40.42,25.57 | v35.88,21.98 35.8,21.98 IC1.T12 | IC1.A1 27,35.73 | 27,35.73 27,36.6 26.38,37.23 v26,37.23 | 27.12,35.98 v27.25,35.98 27,35.73 | IC1.R10 33.8,24.2 33.8,24.8 34,25 34.2,25 | 34.2,25 36.8,25 37,24.8 37,24.4 37.2,24.2 37.6,24.2 37.8,24 37.8,22.62 39.17,21.25 39.62,21.25 39.88,21 v39.88,19.82 | IC1.N10 34.2,25 | 27.8,25.8 v26.1,25.8 | D13.8 D13.3 | D12.8 D12.3 | D10.8 D10.3 | D17.3 D17.8 | D16.3 D16.8 | D15.3 D15.8 | D14.3 D14.8 | D11.3 D11.8
  Top 0.2: IC11.2 v23.4,67.85 | 43.2,58 U5.2 43.2,60.2 42.35,60.2 C31.2 | 43.2,58 43.2,57.8 | 43.2,57.8 43.2,55.8 42.35,55.8 C11.2 | 36.45,45.6 37.3,45.6 v39.8,48.1 39.8,50.85 | 36.45,45.6 31.2,45.6 | 31.2,45.6 C22.1 | 29.55,44.4 v28.4,44.4 28.3,44.5 27.5,44.5 26.4,45.6 26.4,46.4 27.8,47.8 31.6,47.8 31.6,50.6 | 29.55,44.4 31.2,44.4 31.2,45.6 | C10.1 29.55,44.4 | 36.45,45.6 C20.1 v37.55,43.9 | 39.8,50.85 C19.1 | 39.8,50.85 39.8,53.6 39.2,53.6 39.2,53.75 | v41.17,55 39.2,55 | 39.2,56.5 39.2,55 | 39.2,56.5 v40.02,56.5 | v37.48,53.52 36.4,53.52 36.4,51.95 | 36.4,51.95 C8.1 31.6,51.95 | 36.4,51.95 36.4,51.65 C23.1 | C6.1 30.45,53 | 30.45,53 30.45,51.95 31.6,51.95 | 37.65,53.35 v37.48,53.52 | 39.2,55 39.2,53.75 | C9.1 31.6,50.6 | 31.6,50.6 31.6,51.95 | 30.45,53 28.4,53 v28.4,53.6 28.4,57 | v28.1,57 28.4,57 | v28.6,57.7 28.6,57 | 28.4,57 28.6,57 | 28.6,57 31.5,57 | 31.5,57 v31.5,59.6 | 31.5,57 34.6,57 | 34.6,57 v34.6,57.85 | 34.6,57 39.2,57 39.2,56.5 | v37.48,53.52 37.92,53.08 38.52,53.08 39.2,53.75 | 43.2,57.8 v43.25,57.8 | v41.23,57.52 41.7,58 43.2,58 | v44.38,36.58 42.9,38.05 v42.9,40.15 | U4.2 17,64.6 18.8,64.6 | 18.8,64.6 18.8,65.2 C29.1 C24.1 18.8,63.85 18.8,64.6 | v25.58,21.23 26.33,21.98 v26.33,22.12 | v39.85,32.25 40.98,33.38 v41.88,33.38
  Top 0.3: C21.2 23.6,7.35 23.6,6 25.6,6 | 25.6,6 27.6,6 27.6,4.95 C7.2 30.75,4.95 31.09,5.29 U3.4 | IC3.2 25.6,6
  Bottom 0.125: U1.26 31.8,49 U1.77 33,51.2 | U1.29 33,51.2 | U1.36 35.8,51.2 33,51.2 | Q3.4 C35.1 v28.6,57.7 | Q3.4 26.95,58.7 C36.1 v28.1,57 | Q3.2 Q3.4 | v27.25,35.98 27.2,35.98 | v37.55,43.9 37.55,43 36.15,41.6 35.33,41.6 33.8,40.08 v33.8,39.8 | v39.8,48.1 39.8,47.6 40.7,46.7 40.7,42.96 38.4,40.66 38.4,39.6 37.55,38.75 37.55,36.65 | v31.5,59.6 R17.1 | C42.2 v40.02,56.5 | 35.7,58.8 34.75,57.85 v34.6,57.85 D1.3 D1.8 | 28.37,44.72 U1.1 | v28.4,44.4 28.4,43.55 27.58,42.73 25.73,42.73 25.05,43.4 24.48,43.4 24.2,43.12 24.2,37.23 v26,37.23 | v42.7,50.3 42.7,49.55 43.2,49.05 43.2,40.45 v42.9,40.15 | 31.45,19.45 31.5,19.5
  Bottom 0.15: J1.7 35.7,62.09 35.7,58.8 | 28.6,19.6 29.17,19.6 29.33,19.45 31.45,19.45
  Bottom 0.2: v40.1,29.55 40.1,30.1 37.73,30.1 | 25.3,24.2 25.3,25 v26.1,25.8 27.12,25.8 C39.2 30.35,25.75 | 25.3,24.2 25.3,22.6 | 25.3,22.6 25.3,22.27 25.45,22.12 v26.33,22.12 28.83,22.12 29.85,21.1 30.2,21.1 | 27.2,35.98 27.2,34.98 25.92,34.98 25.92,34.62 | v25.2,34.62 25.92,34.62 | 36,36.65 37.55,36.65 38,36.65 39,35.65 v39.85,35.65 v39.85,32.25 39.85,32.83 C1.2 37.73,32.83 37.73,30.1 | C37.2 44.05,60.15 43.2,60.15 U5.2 43.2,58 | 43.2,58 43.2,57.8 | 43.2,57.8 43.2,55.8 44.25,55.8 C14.2 | C3.1 v41.17,55 41.17,54.25 37.85,54.25 37.48,53.88 v37.48,53.52 | C12.1 v23.4,67.85 | C2.1 42.05,51.65 v42,51.6 | 43.2,57.8 v43.25,57.8 | 43.2,58 41.7,58 v41.23,57.52 | v33.8,39.8 33.55,39.55 33.55,37.86 34.76,36.65 36,36.65 | RN10.3 42.42,31.15 | RN10.1 42.42,29.55 | 42.42,31.15 42.42,29.55 | 42.42,31.15 42.42,32.88 | 42.42,32.88 42.38,32.88 v41.88,33.38 | 42.42,32.88 44.38,32.88 v44.38,34.35 44.75,34.35 44.75,36.58 v44.38,36.58 | 42.42,29.55 42.42,28.6 | v43.3,28.6 42.42,28.6 | RN5.3 25.3,22.6 | RN5.1 25.3,24.2 | 35.17,21.98 35.17,20.95 35.55,20.57 36.55,20.57 RN13.1 36.6,19.82 | 35.17,21.98 v35.88,21.98 35.92,22.02 39.73,22.02 v40,22.3 | 35.17,21.98 33.75,21.98 33.75,24.18 | C40.2 33.75,24.18 | 33.75,24.18 33.75,25.75 | 33.75,25.75 32.2,25.75 | 32.2,25.75 30.35,25.75 | 33.75,25.75 33.75,26.77 36,26.77 | C16.2 36,26.57 36,26.77 | C5.2 36,28.4 | 36,28.4 36,26.77 | 36,28.4 36,30.1 | 36,30.1 37.73,30.1 | 36,30.1 36,36.65 | v30.35,22.05 30.35,25.75 | 42.42,28.6 42.42,26.45 | 42.42,26.45 RN11.3 | 42.42,26.45 42.42,24.85 | RN11.1 42.42,24.85 | 42.42,24.85 42.42,23.85 | v41.75,23.85 42.42,23.85 | 42.42,23.85 43.42,23.85 v43.42,23.88 | 42.42,23.85 42.42,22.1
  Bottom 0.2: 42.42,22.1 RN12.3 | 42.42,22.1 42.42,20.5 | RN12.1 42.42,20.5 | 42.42,20.5 42.42,19.5 | 43.62,19.38 43.62,19.5 42.42,19.5 | 42.42,19.5 39.88,19.5 v39.88,19.82 38.2,19.82 | RN13.3 38.2,19.82 | 38.2,19.82 36.6,19.82 | v25.58,21.23 25.9,20.9 25.9,20.35 | RN3.3 25.9,18.75 | 25.9,20.35 25.9,18.75 | RN3.1 25.9,20.35 | 25.9,18.75 25.9,17.25 24.77,17.25 C32.2 24.77,15.25 27.67,15.25 27.67,19.38 27.9,19.6 28.6,19.6 RN1.1 | RN1.3 30.2,21.1 | 30.2,21.1 31.2,21.1 31.5,20.8 31.5,19.5 31.5,19.07 v31.8,18.77 35.2,18.77 36.25,19.82 36.6,19.82 | 27.52,34.2 C30.1 27.1,31.9 27.1,30.88 C38.2 25.85,30.73 25.85,30.62 25.7,30.62 25.14,30.06 25.11,30.06 | 25.92,34.62 25.92,34.2 27.52,34.2 | 27.52,34.2 32.2,34.2 32.2,25.75 | 25.11,30.06 v25.1,30.05 | Q1.P$2 24.1,30.56 24.6,30.06 25.11,30.06
  other vias: 5.97,72.78 18.27,72.72 26.05,63.08 5.28,68.88 2.2,67.4 59.55,3.8 29.58,66.47 23.88,72.58 61,73.2 63.2,67.4 24,61.2 38.1,16.05 29.77,15.9 23.25,15.62 23.12,29.67 19.9,23 21.8,18.3 41.75,69.88 51.75,9.15 63.53,57.52 1.45,26.05 35.45,6.25 42.55,6.25 30.65,5.3 30.65,6.55 31.8,14.05 42.65,4.95 45.4,5.1 46.05,8.5 59.6,10.4 58.2,24.4 52.4,20.4 62.47,59.9 48.08,71.1 9.85,48.95 9.43,37.55 10.25,29.35 10.3,9.3 16.7,7.85 28.65,8.8 44.05,6.3 48.6,1.4 47,1.4 50.2,1.4 25.7,66.42 25.83,64.45 38.8,65.4 31.7,63.85 31.7,62.2 40.2,53.9 24.02,69.92 27.1,66.85 27.83,63.1 31.5,61.08 29.9,71.9 36.1,71.9 55.2,51.8 54.6,63.3 25.15,67.8 64.5,46.9 63.88,43.52 63.45,40.58 63.58,37.5 64.55,18.82 63.55,29.4 63.67,25.62 60.38,61.92 54.8,24.2 54.6,20.8 55.8,11.4 2.18,18.07 1.5,23.18 1.97,47.9 2.57,54.33 2.68,55.7 2.25,58.5 2.93,60.3 63.6,15.32 48.8,68.05 52.5,67.75 45.95,67.9 42.1,68.15 37.33,67.55 37.5,8.5 48.6,10.2 41.4,8.4 48.62,8.97 50.5,7.5 37.1,6.35 12.6,9.2 21.52,16.2 8.1,36.08 8.1,37.55 9.38,52.1 7.62,60.92 6.2,49.33 3.38,49.55 3.25,53.38 7.22,53.52 36.2,68 59.83,26.5 59.83,24.68 58.62,21.12 58.33,36.25 58.1,38.12 58.88,41.52 59.8,48.98 62.25,47.95 58.25,50.73 62.33,52.55 62.4,56.88 62.83,49.48 63.38,33.25 63.4,21.15 42.02,72.7 47.65,72.83 7.62,21.23 2.45,41.75 2.38,37.08 2.6,33.5 64.05,53.65 65.03,12.72 63.2,6.6 2.2,6.8 56.8,9.2 51.85,5.9 61.58,15.57 52.88,3.95 56.73,4.5 56.6,7.03 2.25,44.5 2.25,30.48 2.15,16.5 5.6,5 2,13.2 2,46.6 8.2,51.2 7.38,33.33 6.32,27.2 7.22,23.23 56.4,67.58 55.52,66.47 50.9,62.85 48.5,65.92 16.75,45.75 16.75,59.75 16.75,17.75 15.5,27 46.35,31.4 46.5,26.25 46.88,21.25 48.12,21.88 46.75,23.88 49.25,56 49.25,42 36.1,14.55 48.58,16.9 47.3,18.62 50.5,20.5 50.75,25.75 15,10 16.75,10 14.75,8 15.25,20.25 22,46 16,51 16,49 16,53 16,55 15.25,56.95 14.25,56.95 22,43 22,42 22,41 22,40 22,38 22,34.6 15.5,42.7 15.5,41.5 15.5,40.5 15.5,39.5 15.5,35.5 14.75,34.75 28.5,12 27.5,12 26.5,12 25.5,12 24.5,12 22.5,12 18.5,12 17.5,12 16.5,12 15.5,12 14.5,12 39.75,12.75 41.75,12.75 43.25,12.75 44.25,12.75 45.15,12.72 41.75,17.75 43.25,17.75 43.25,17 41.75,17 41.75,19.25 43.25,19.25 40.5,18.5 45.75,46.5 45.75,45.5 45.75,44.5 45.75,43.5 45.75,42.5 45.75,41.5 45.75,40.5 45.75,39.5 45.75,38.5 45.75,37.5 45.75,36.5 45.75,35.5 45.75,34.5 45.75,47.5 45.75,48.5 46.25,49.5 22,35.6 22,37 22,39 22,44 22,45 51,31 51,32 51,33 51,34 51,35 51,39 51,45 51,46 51,47 51,48 51,49 51,53 47,59.5 46.75,58.5 46.75,57.5 46.75,56.5 46.75,55.5 46.75,54.5 46.75,53.5 46.75,52.5 46.75,51.5 46.75,50.5 48,60 49,60 50,60 51,60 52,60 17.25,62 16.25,62 15.25,62 14.25,62 18,61.5 18.75,61 19.5,60.25 20,59.5 20.5,58.75 20.75,57.75 20.75,56.75 20.75,55.75 20.75,54.75 20.75,53.75 20.75,52.75 20.75,51.75 20.75,50.75 20.75,49.75 20.75,48.75 21.27,47.85 21.62,46.83 16,56 16,54 16,52 16,50 15,48.5 14,48.5 13.25,56.45 14.5,43.4 19.5,12 20.5,12 21.5,12 23.5,12 29.5,12 30.65,12.4 36.52,13.82 37.35,13.48 38.67,12.78 40.75,12.75 46.25,12.75 47.12,12.12 48,11.5 49,11.5 50,11.5 51,11.5 52,11.5 8.18,15.43 16,9 17,4.5 16,0.75 16,4.5 16,2.5 17.5,0.75 19,0.75 20.5,0.75 22,0.75 17,2.5 23.5,0.75 32.62,11.15 31.7,13.15 40.98,16.38 44.38,62.62 42.12,63.25 41,63.25 38.62,63.5 37.75,60.25 35.38,62.75 37.38,62.75 22.25,57.25 22.25,56 22.25,54.75 9.43,36.08 15.8,38.4 15.8,37.4 5.6,21.4 6,15.8 2.4,27.9 2.38,26.55 2.38,40.35 2.97,58.98 62.45,58.25 63.08,45.55 63.05,43.73 52.52,61.25 53.08,59.98 55.08,59.9 53,63.33 57.95,58.77 57.75,56.15 58.2,53.85 58.17,42.52 57.95,44.6 58.47,43.65 58.72,29.33 58.55,27.55 59.97,28.48 58.35,25.75 8.8,34.8 6.68,46.92 7.93,48.75 9.98,50.48 6.2,59.4 7.65,59.5 13.62,63.42 46.6,17.2 49.6,19 50.4,17.2 51.4,18.8 52,17.4 59,15.4 58.2,14.2 62.8,13.4 14.2,15.2 16.4,15.2 15.6,33.8
  pour Bottom (isolate 0.15, rank 3): -4,77 68.6,77 68.6,-1 -4,-1
  pour Top (isolate 0.15): -5,78 70,78 70,-2 -5,-2
GPIO0  (via drill 0.3)
  Top 0.15: v21.05,66.88 20.9,67.03 20.9,67.58 20.62,67.85 15.54,67.85 12.09,64.4 v10.6,64.4
  Top 0.2: R21.1 41.8,7.6 41.4,7.2 41.4,5 41,4.6 31.2,4.6 30.06,3.46 22.43,3.46 20.5,5.39 v19.8,5.39 | v10.55,63 10.25,63.3 8.1,63.3 4.47,59.67 4.47,14.68 7.3,11.85 7.3,10.65 11.32,6.62 19.73,6.62 v19.8,6.69
  Bottom 0.125: U1.17 26.92,51.8 23.75,54.97 23.75,60.1 21,62.85 21,66.83 v21.05,66.88
  Bottom 0.2: v21.05,66.88 20.75,66.88 16.62,71 14.54,71 J4.6 | v10.55,63 10.55,64.1 10.6,64.15 v10.6,64.4 | v19.8,6.69 v19.8,5.39
GPIO1  (via drill 0.3)
  Top 0.125: v21.5,67.73 21.11,68.11 15.39,68.11 12.24,64.96 10.21,64.96 v9.73,64.47
  Top 0.2: v9.62,62.7 7.96,62.7 4.8,59.54 4.8,14.81 7.62,11.98 7.62,10.79 10.61,7.8 v11.6,7.8 | U8.3 12.27,1.6 v10.9,1.6
  Bottom 0.125: U1.18 26.88,52.2 24,55.08 24,60.2 21.25,62.95 21.25,66.08 21.62,66.45 21.62,67.61 v21.5,67.73
  Bottom 0.2: J4.8 15.94,72.27 20.48,67.73 v21.5,67.73 | v9.73,64.47 9.62,64.38 v9.62,62.7 | v11.6,7.8 11.45,7.65 11.45,4.53 10.45,3.53 10.45,2.05 v10.9,1.6 14.55,1.6 R23.2
INITN  (via drill 0.3)
  Top 0.125: IC1.T9 33.4,22.46 33.98,21.88 33.98,13.38 36.66,10.7 43.75,10.7 44.27,10.18 R1.1
  Top 0.2: v49.5,10.2 v49.5,9 | R1.1 v46,9.4
  Bottom 0.2: v49.5,10.2 48.9,10.8 47.4,10.8 v46,9.4 | J2.2 57.14,2.4 50.54,9 v49.5,9
JTAG_TCK  (via drill 0.3)
  Top 0.125: IC1.T10 34.2,22.37 34.48,22.09 34.48,13.59 36.87,11.2 45.94,11.2 47.2,9.94 47.2,7.6 47.4,7.4 v47.4,6.6
  Top 0.2: v47.4,6.6 47.4,5.65 R2.2
  Bottom 0.2: v47.4,6.6 47.4,5.3 X1.4 47.6,4.05 47.35,3.8 37.14,3.8 J3.2
JTAG_TDI  (via drill 0.3)
  Top 0.125: IC1.R11 34.6,23.4 34.6,22.32 34.73,22.19 34.73,13.69 36.98,11.45 46.04,11.45 47.45,10.04 47.45,7.75 v48.4,6.8
  Bottom 0.2: v48.4,6.8 48.6,6.6 X1.3 48.6,4.05 48.02,3.47 39.35,3.47 J3.3
JTAG_TDO  (via drill 0.3)
  Top 0.125: IC1.M10 34.6,25.8 37.6,25.8 37.8,25.6 37.8,24.4 38,24.2 39.5,24.2 40.35,23.35 v40.52,23.35 | v35.85,21.15 36.17,20.82 36.17,19.77 35.51,19.11 35.51,13.98 36.59,12.9 37.65,12.9 38.6,11.95 46.25,11.95 47.95,10.25 47.95,8.7 49.25,7.4 v49.6,7.4
  Bottom 0.2: v40.52,23.35 40.65,23.23 40.65,22.02 40.33,21.7 36.5,21.7 35.95,21.15 v35.85,21.15 | v49.6,7.4 X1.2 49.6,3.95 48.8,3.15 41.57,3.15 J3.4
JTAG_TMS  (via drill 0.3)
  Top 0.125: IC1.T11 35,13.78 37.08,11.7 46.15,11.7 47.7,10.15 47.7,8.45 49.55,6.6 v50.6,6.6
  Bottom 0.2: v50.6,6.6 X1.1 50.6,3.85 49.58,2.83 43.78,2.83 J3.5
LEDCTRL
  Top 0.2: LED4.4 2.8,14.36 | 2.8,14.36 3.01,14.36 6.05,11.32 6.05,10.2 8.6,7.64 J5.1 | R27.2 2.8,19.75 2.8,14.36
MCLK  (via drill 0.3)
  Top 0.125: IC1.K2 27.4,28.2 26.05,28.2 v25.91,28.34
  Bottom 0.125: v25.91,28.34 25.86,28.34 23.9,30.3 23.02,30.3 22.3,31.02 Q1.P$3
N$1
  Top 0.3: U$50.A2 57.67,61.13 59.4,59.4 R15.2
N$2
  Top 0.3: U$50.B2 59.34,47.16 R16.2
N$3
  Top 0.3: IC3.5 24.65,10.2 L1.2
N$4
  Top 0.3: U$50.C2 57.61,33.19 58.12,32.67 58.12,31.17 58.4,30.9 R18.2
N$5
  Top 0.3: U$50.D2 57.68,19.22 58.6,18.3 R20.2
N$6
  Top 0.3: U$50.A1 52.45,62.4 R35.2
N$7  (via drill 0.3)
  Top 0.2: IC11.5 v23.4,63.05
  Top 0.3: v23.4,63.05 23.11,62.76 JP3.1
  Bottom 0.2: v23.4,63.05 C12.2
N$8
  Top 0.2: R5.1 41.3,65.9 41.1,65.7 40.3,65.7 40.1,65.5 R6.2
N$9
  Top 0.2: J1.1 R5.2
N$10  (via drill 0.3)
  Top 0.3: U8.5 16.46,3.54 v16.5,3.5
  Bottom 0.3: v16.5,3.5 18.25,3.5 Q4.4
N$11  (via drill 0.3)
  Bottom 0.3: Q4.5 18.34,9.25 19.61,9.25 | 22.16,8.5 22.16,9.25 20.89,9.25 | Q4.6 19.61,9.25 | 19.61,9.25 20.89,9.25 | Q4.7 20.89,9.25
  Bottom 0.4: R22.2 v23.75,1.8 23.75,4.28 22.16,5.87 22.16,8.5 Q4.8
N$12
  Top 0.3: U$50.B1 56.8,48.58 R34.2
N$13
  Top 0.3: U$50.C1 56.65,36.6 R33.2
N$14
  Top 0.3: LED1.4 0.7,56.16 0.7,45.84 LED2.1
N$15
  Top 0.3: U$50.D1 56.8,20.64 R32.2
N$16
  Top 0.3: R11.2 6.78,14.43 8.33,12.87 U$49.A2
N$17
  Top 0.3: R12.2 6.8,28.2 8.16,26.84 U$49.B2
N$18
  Top 0.3: R13.2 7.3,43.9 7.6,43.6 7.6,41.6 8.39,40.81 U$49.C2
N$19
  Top 0.3: LED2.4 0.7,42.16 0.7,31.84 LED3.1
N$22
  Top 0.3: R14.2 7.3,56.5 7.8,56 7.8,55.4 8.42,54.78 U$49.D2
N$23
  Top 0.2: LED3.4 0.7,28.16 | 0.7,17.84 LED4.1
  Top 0.3: 0.7,28.16 0.7,17.84
N$24
  Top 0.3: U$49.A1 12.45,11.6 14,13.15 14,13.5 R28.2
N$25
  Top 0.3: LED7.1 65.3,28.16 65.3,17.84 LED6.4
N$26
  Top 0.3: D3.C 6.55,19.15 R11.1
N$27
  Top 0.2: LED5.4 31.36,70.69 29.45,68.78 22.99,68.78 22.62,68.4 15.2,68.4 12.05,65.25 8.87,65.25 3.26,59.64 LED1.1
N$28
  Top 0.3: U$49.B1 9.05,25.27 R29.2
N$29
  Top 0.3: LED8.1 65.3,42.16 65.3,31.84 LED7.4
N$30
  Top 0.3: U$49.C1 9.48,39.66 13.52,39.66 R30.2
N$31
  Top 0.3: R31.2 14.05,53.6 9.44,53.6 U$49.D1
N$32
  Top 0.3: LED9.1 65.3,56.16 65.3,45.84 LED8.4
N$34
  Top 0.2: LED5.1 34.64,71.36 37.2,68.8 42.5,68.8 44.58,66.72 48.67,66.72 50.27,65.12 57.78,65.12 59.53,63.39 59.53,61.65 61.94,59.24 63.7,59.24 64.1,59.64 LED9.4
N$35
  Top 0.3: D2.C 6.57,34.77 6.57,31.1 R12.1
N$39
  Top 0.3: D4.C 6.57,39.23 6.57,42.1 R13.1
N$41
  Top 0.3: D5.C 6.35,54.6 R14.1
N$47
  Top 0.3: D6.C 59.5,51.15 59.5,56.3 R15.1
N$49
  Top 0.3: D7.C 59.53,39.12 59.53,45.3 R16.1
N$51
  Top 0.3: D8.C 59.65,32.7 R18.1
N$53
  Top 0.3: D9.C 59.65,20.1 R20.1
OEN  (via drill 0.3)
  Top 0.125: IC1.K1 25.67,27.8 25.38,28.1 25.38,28.62 23.35,30.65 23.35,32.59 22.6,33.34 22.6,45.38 24.4,47.17 24.4,48.8 v25.25,49.65
  Bottom 0.125: U1.13 27.26,50.2 27.12,50.06 26.4,50.06 25.99,49.65 v25.25,49.65 24.23,49.65 RN8.1
PB4A  (via drill 0.3)
  Top 0.125: IC1.T6 31,22.53 31.15,22.38 31.15,21.68 32.38,20.45 32.38,12.93 31.73,12.28 v31.55,12.28
  Bottom 0.125: JP1.2 35.19,7.6 34.29,8.5 32.59,8.5 32.05,9.04 32.05,11.78 v31.55,12.28
PCSN  (via drill 0.3)
  Top 0.125: IC1.N8 32.2,25 32.2,22.6 33.23,21.57 33.23,10.68 v33.31,10.6 33.31,9.11 U3.1
  Bottom 0.2: R10.2 33.35,10.56 v33.31,10.6
PL26A
  Top 0.125: IC1.L1 25.75,27 24.8,27.95 RN9.3
PL26B
  Top 0.125: IC1.L2 27.4,27.4 25.72,27.4 25.12,28 25.12,28.52 24.89,28.75 RN9.4
PL26C
  Top 0.125: IC1.M1 26.48,26.2 26.33,26.35 RN9.1
PL26D
  Top 0.125: RN9.2 25.22,27.15 25.77,26.6 27.4,26.6 IC1.M2
PL32A
  Top 0.125: IC1.N1 26.5,25.4 26.35,25.25 25.02,25.25 24.43,24.65 RN6.4
PL32B
  Top 0.125: IC1.P2 27.4,25 25.27,25 25.1,24.82 25.1,23.52 24.98,23.4 RN6.3
PL35A
  Top 0.125: IC1.P1 25.65,24.6 25.35,24.3 25.35,22.9 25.05,22.6 RN6.2
PL35B
  Top 0.125: IC1.R1 26.5,23.8 25.6,22.9 25.6,22.35 25.05,21.8 RN6.1
PL38C
  Top 0.125: IC1.R2 27.4,23.4 27.4,21.98 26.05,20.62 26.05,19.65 26.15,19.55 RN4.3
PL38D
  Top 0.125: IC1.T2 27.8,22 26.67,20.88 RN4.4
PL41A
  Top 0.125: IC1.P4 29.8,24.2 30.4,24.2 30.6,24 30.6,22.57 30.9,22.27 30.9,21.52 31.48,20.95 31.48,19.8 31.27,19.6 29.6,19.6 29.4,19.8 RN2.3
PL41B
  Top 0.125: IC1.R3 29,23.4 29,21.6 28.6,21.2 RN2.4
PL41C
  Top 0.125: IC1.R4 29,24.2 28.4,24.2 28.2,24 28.2,21.77 27.42,21 27.42,18.93 27.25,18.75 RN4.2
PL41D
  Top 0.125: IC1.T3 28.6,21.8 27.67,20.88 27.67,18.27 27.35,17.95 RN4.1
PL44A
  Top 0.125: IC1.R5 29.8,23.4 29.8,21.59 30.23,21.16 30.79,21.16 31,20.95 RN2.1
PL44B
  Top 0.125: IC1.T4 29.4,21.63 30.2,20.83 RN2.2
PMISO
  Top 0.125: IC1.T7 31.8,22.65 32.98,21.46 32.98,12.33 30.8,10.15 30.8,8.2 31.16,7.84 U3.2
PMOSI
  Top 0.125: IC1.T8 32.6,22.55 33.48,21.67 33.48,13.18 35.75,10.91 35.75,6.8 37.26,5.29 U3.5
PR20A
  Top 0.125: IC1.G16 39.5,30.2 39.65,30.35 40.42,30.35 40.62,30.55 40.62,31.45 41.12,31.95 RN15.1
PR20B
  Top 0.125: IC1.H15 38.6,29.8 39.48,29.8 39.77,30.1 40.52,30.1 40.88,30.45 40.88,30.98 41.05,31.15 RN15.2
PR23A
  Top 0.125: IC1.J16 39.58,28.6 39.73,28.75 40.65,28.75 40.9,29 40.9,29.4 41.05,29.55 RN15.4
PR23B
  Top 0.125: IC1.J15 38.6,29 40.55,29 40.65,29.1 40.65,29.83 41.08,30.25 41.58,30.25 RN15.3
PR26A
  Top 0.125: IC1.L16 40.77,27 41.2,26.57 41.58,26.57 RN17.2
PR26B
  Top 0.125: IC1.L15 38.6,27.4 41.55,27.4 RN17.1
PR32A
  Top 0.125: IC1.N16 39.42,25.4 40.3,24.52 40.92,24.52 41.14,24.74 41.14,25.41 41.25,25.52 41.7,25.52 RN17.3
PR32B
  Top 0.125: IC1.P15 38.6,25 39.45,25 40.17,24.27 41.02,24.27 41.6,24.85 RN17.4
PR35A
  Top 0.125: IC1.P16 39.48,24.6 40.17,23.9 40.85,23.9 41.08,23.68 41.08,23.04 41.21,22.9 RN19.1
PR35B
  Top 0.125: IC1.R16 39.52,23.8 39.77,23.55 39.77,23.3 40.98,22.1 RN19.2
PR38C
  Top 0.125: IC1.R15 38.6,23.4 38.6,22.53 39.38,21.75 40.3,21.75 40.75,21.3 RN19.3
PR38D
  Top 0.125: IC1.T15 38.2,22.58 39.28,21.5 39.88,21.5 40.88,20.5 RN19.4
PR41C
  Top 0.125: IC1.R13 37,23.4 37,22.45 38.2,21.25 RN21.2
PR41D
  Top 0.125: RN21.1 38.9,20.62 38.9,21.17 38.25,21.82 37.98,21.82 37.4,22.4 IC1.T14
PR44A
  Top 0.125: IC1.R12 36.2,23.4 36.2,22.48 36.6,22.07 RN21.4
PR44B
  Top 0.125: RN21.3 37.4,21.68 36.6,22.48 IC1.T13
PROGRAMN  (via drill 0.3)
  Top 0.125: IC1.R9 33.8,23.4 33.8,22.41 34.23,21.98 34.23,13.48 36.77,10.95 45.05,10.95 v45.4,10.6
  Top 0.2: v46.8,7.2 46.8,7.6 | 46.8,7.6 R21.2 | v45.4,10.6 46,10.6 46.8,9.8 46.8,7.6
  Bottom 0.2: 45.4,9 v45.4,10.6 R9.2 | R4.2 45.4,9 | 45.4,9 45.4,7.95 45.05,7.6 44.45,7.6 C13.1 | v46.8,7.2 47.92,8.32 50.67,8.32 54.6,4.4 J2.1
PSCK  (via drill 0.3)
  Top 0.125: IC1.N9 33,25 33,22.51 33.73,21.77 33.73,13.28 36,11.01 36,9 v37.4,7.6
  Top 0.2: U3.6 37.84,6.56 37.4,7 v37.4,7.6
  Bottom 0.2: R7.2 v37.4,7.6 JP1.1
QB2  (via drill 0.3)
  Top 0.125: IC1.B2 27.4,34.6 26.65,34.6 26.5,34.75 26.5,35.9 v26,36.4
  Top 0.2: v15.38,36.48 15.2,36.65 15.2,37.88 14.02,39.05 12.25,39.05 10,36.8 5.6,36.8 5.12,36.33 5.12,23.27 v5.6,22.8 | R27.1 v2.6,22.8
  Bottom 0.125: v26,36.4 25.92,36.33 15.52,36.33 v15.38,36.48
  Bottom 0.2: v5.6,22.8 v2.6,22.8
QC16  (via drill 0.3)
  Top 0.125: v41.77,34.77 40.85,34.77 39.48,33.4 IC1.C16
  Top 0.3: v51.4,67.8 J8.3
  Bottom 0.125: v41.77,34.77 41.77,34.8 43.17,36.2 43.17,37.1 44.62,38.55 44.62,50.12 45.62,51.12 45.62,65.7 47.3,67.38 50.82,67.38 51.25,67.8 v51.4,67.8
QD16  (via drill 0.3)
  Top 0.125: IC1.D16 39.42,32.6 40.75,33.92 42.6,33.92 v42.65,33.98
  Top 0.25: v54,68.2 54,71 J8.4
  Bottom 0.125: v42.65,33.98 42.65,35.32 43.42,36.09 43.42,37 44.88,38.45 44.88,50.01 45.88,51.01 45.88,65.6 47.4,67.12 52.92,67.12 v54,68.2
QF16  (via drill 0.3)
  Top 0.125: IC1.F16 39.41,31 39.87,31.45 40.27,31.45 40.81,31.99 40.81,32.3 41.09,32.58 42.43,32.58 43.7,33.85 43.7,34.98 44.02,35.3 v44.02,35.45
  Top 0.3: v55,67.4 J8.5
  Bottom 0.125: v44.02,35.45 43.67,35.8 43.67,36.9 45.12,38.34 45.12,49.91 46.12,50.91 46.12,65.5 47.5,66.88 54.48,66.88 v55,67.4
QK16  (via drill 0.3)
  Top 0.125: IC1.K16 39.42,27.8 39.57,27.65 41.05,27.65 41.33,27.93 42.08,27.93 42.5,27.5 42.5,18.57 v42.48,18.55
  Bottom 0.125: 42.48,10.68 R9.1
  Bottom 0.2: v42.48,18.55 42.48,10.68
QR2A  (via drill 0.3)
  Top 0.125: IC1.B16 39.52,34.2 41.3,35.98 v41.8,35.98
  Top 0.3: v48,68.8 J8.1
  Bottom 0.125: v41.8,35.98 42.6,35.98 42.92,36.3 42.92,37.2 44.38,38.66 44.38,50.22 45.38,51.22 45.38,65.92 48,68.55 v48,68.8
QR2B  (via drill 0.3)
  Top 0.125: IC1.B15 38.6,34.6 38.6,35.8 39.25,36.45 41.45,36.45 v41.8,36.8
  Top 0.3: v48,69.8 J8.2
  Bottom 0.125: v48,69.8 47.4,69.2 47.4,68.33 45.12,66.05 45.12,51.33 44.12,50.33 44.12,38.76 42.17,36.8 v41.8,36.8
RDN  (via drill 0.3)
  Top 0.125: IC1.J1 26.55,28.6 26.27,28.88 25.47,28.88 23.6,30.75 23.6,32.7 22.85,33.45 22.85,45.25 24.65,47.05 24.65,48.33 25.17,48.85 v25.7,48.85
  Bottom 0.125: U1.12 26.65,49.8 v25.7,48.85 25.65,48.9 RN8.2
RESET_N  (via drill 0.3)
  Top 0.2: v25.25,51.4 24.35,51.4 C33.2
  Bottom 0.125: J4.5 14.77,68.23 18.33,68.23 20.5,66.06 20.5,62.64 23.25,59.89 23.25,54.75 25.25,52.75 v25.25,51.4 | U1.15 27.01,51 26.61,51.4 v25.25,51.4 | v25.25,51.4 R19.2
RXFN  (via drill 0.3)
  Top 0.125: IC1.G2 27.4,30.6 26.52,30.6 23.35,33.77 23.35,43.75 v24.5,44.9
  Bottom 0.125: U1.9 27.17,48.6 24.5,45.92 v24.5,44.9
SIWUN
  Bottom 0.125: U1.10 27.2,49 25.5,47.3 RN8.4
SSRX+
  Bottom 0.125: U1.35 35.4,55.1 35.6,55.3 D1.6 D1.5
  Bottom 0.15: J1.9 36.55,64.09 36.55,58.76 35.5,57.71 35.5,57.45 35.6,57.35 D1.5
SSRX-
  Bottom 0.125: U1.34 35,54.5 35.15,54.65 35.15,55.1 35.1,55.15 D1.7 D1.4
  Bottom 0.15: J1.8 36.2,64.09 36.2,58.8 35.2,57.8 35.2,57.45 35.1,57.35 D1.4
SSTX+
  Bottom 0.15: J1.6 29.8,64.09 29.8,63.5 30.1,63.2 33.3,63.2 34.1,62.4 34.1,61.95 34.3,61.75 34.3,61.15
  Bottom 0.2: 34.3,61.15 C26.2
SSTX-
  Bottom 0.15: 33.4,61.15 33.4,61.75 33.6,61.95 33.6,62.4 33.12,62.88 29.97,62.88 29.48,63.36 29.48,64.06 J1.5
  Bottom 0.2: 33.4,61.15 C25.2
SSTXI+
  Bottom 0.125: U1.32 34.2,54.5 34.05,54.65 34.05,55.12 34.1,55.17 D1.9 D1.2 34.1,57.35 34,57.45 34,58.1 34.25,58.35 34.25,58.8 C26.1
SSTXI-
  Bottom 0.125: U1.31 33.8,55.12 33.6,55.33 D1.10 D1.1 33.6,57.35 33.7,57.45 33.7,58.1 33.45,58.35 33.45,58.8 C25.1
TA1  (via drill 0.3)
  Top 0.125: D10.10 D10.1 16.25,16.75 16.38,16.88 17.02,16.88 20.3,13.6 29.55,13.6 31.2,15.25 31.2,15.95 31.35,16.11 31.35,16.6 R48.1 | RN1.5 31,18.27 v31.38,17.9 31.48,17.8 31.48,17.08
  Top 0.152: R48.1 31.48,17.08
  Top 0.2: D10.10 13.23,16.75 U$49.A4
  Bottom 0.125: v31.38,17.9 31,18.27 RN1.5
TA2  (via drill 0.3)
  Top 0.125: D10.9 D10.2 16.25,17.25 16.38,17.12 17.12,17.12 20.4,13.85 29.45,13.85 30.95,15.35 30.95,15.95 30.8,16.11 30.8,16.6 R48.2 | R48.2 30.5,17.85 v30.52,17.88 30.2,18.2 RN1.6
  Top 0.152: R48.2
  Top 0.2: U$49.A5 12.68,16.68 13.25,17.25 D10.9
  Bottom 0.125: v30.52,17.88 30.2,18.2 RN1.6
TA3  (via drill 0.3)
  Top 0.125: R47.1 28.88,16.6 28.88,16.05 28.73,15.9 28.73,15.07 28.15,14.5 21.27,14.5 17.4,18.38 16.38,18.38 16.25,18.25 D10.4 D10.7 | 29.05,17.83 29.05,17.02 | RN1.7 29.4,18.18 v29.15,17.93
  Top 0.152: R47.1 29.05,17.02 | v29.15,17.93 29.05,17.83
  Top 0.2: U$49.A7 12.58,19.22 13.55,18.25 D10.7
  Bottom 0.125: v29.15,17.93 29.4,18.18 RN1.7
TA4  (via drill 0.3)
  Top 0.125: R47.2 28.32,16.6 28.32,16.05 28.48,15.9 28.48,15.18 28.05,14.75 21.38,14.75 17.5,18.62 16.38,18.62 16.25,18.75 D10.5 D10.6 | 28.17,17.05 28.17,17.77 v28.33,17.93 28.6,18.2 RN1.8
  Top 0.152: R47.2 28.17,17.05
  Top 0.2: U$49.A8 13.63,18.75 D10.6
  Bottom 0.125: v28.33,17.93 28.6,18.2 RN1.8
TB1  (via drill 0.3)
  Top 0.125: R46.2 22.92,17.05 22.6,17.05 22.43,17.23 20.45,17.23 16,21.67 16,24.75 14.62,26.12 14.62,27.38 14.5,27.5 D11.1 D11.10 | 23.52,17.09 23.77,17.09 24.23,17.55 | 24.88,17.82 24.45,17.82 v24.23,17.6
  Top 0.152: R46.2 23.52,17.09 | 24.23,17.55 v24.23,17.6 | RN3.5 25,17.95 24.88,17.82
  Top 0.2: U$49.B4 12.82,30.31 14.25,30.31 14.5,30.06 D11.10
  Bottom 0.125: RN3.5 25,17.82 24.45,17.82 v24.23,17.6
TB2  (via drill 0.3)
  Top 0.125: R46.1 22.92,17.65 22.6,17.65 22.43,17.48 20.55,17.48 16.25,21.77 16.25,24.88 14.88,26.25 14.88,27.38 15,27.5 D11.2 D11.9 | 23.5,18.23 24,18.23 v24.2,18.43 24.4,18.62 25,18.62
  Top 0.152: R46.1 23.5,18.23 | RN3.6 25,18.62
  Top 0.2: D11.9 15,30.06 14.41,30.65 U$49.B5
  Bottom 0.125: RN3.6 25.1,18.75 24.98,18.62 24.4,18.62 v24.2,18.43
TB3  (via drill 0.3)
  Top 0.125: R45.1 22.92,19.55 22.5,19.55 22.32,19.73 19.67,19.73 17.12,22.27 17.12,25 16.12,26 16.12,27.38 16,27.5 D11.4 D11.7 | 23.35,19.42 24.17,19.42 v24.23,19.48 24.3,19.55 RN3.7
  Top 0.152: R45.1 23.35,19.42
  Top 0.2: U$49.B7 13.67,33.19 16.07,30.8 16.07,30.06 16,30 D11.7
  Bottom 0.125: RN3.7 24.3,19.55 v24.23,19.48
TB4  (via drill 0.3)
  Top 0.125: R45.2 22.92,20.15 22.5,20.15 22.32,19.98 19.77,19.98 17.38,22.38 17.38,25.12 16.38,26.12 16.38,27.38 16.5,27.5 D11.5 D11.6 | v24.22,20.36 23.27,20.36 | RN3.8 v24.23,20.35
  Top 0.152: R45.2 23.27,20.36 | v24.22,20.36 v24.23,20.35
  Top 0.2: U$49.B8 12.82,33.53 13.82,33.53 16.43,30.91 16.43,30.06 16.5,30 D11.6
  Bottom 0.125: RN3.8 v24.23,20.35
TC1  (via drill 0.3)
  Top 0.125: D12.10 D12.1 16.25,44.75 16.38,44.88 16.75,44.88 17,44.62 17,31.88 17.38,31.5 17.38,26.12 18.25,25.25 18.25,22.5 19.22,21.52 19.55,21.52 19.8,21.27 20.75,21.27 R44.2 | 21.25,21.37 21.64,21.37 v21.98,21.7 22.07,21.8 RN6.8
  Top 0.152: R44.2 21.25,21.37
  Top 0.2: D12.10 13.29,44.75 U$49.C4
  Bottom 0.125: RN5.5 22.07,21.8 v21.98,21.7
TC2  (via drill 0.3)
  Top 0.125: D12.9 D12.2 16.25,45.25 16.38,45.12 16.88,45.12 17.25,44.75 17.25,32 17.62,31.62 17.62,26.23 18.5,25.35 18.5,22.6 19.32,21.77 19.55,21.77 19.8,22.03 20.75,22.03 R44.1 21.66,22.23 v21.98,22.55 22.82,22.55
  Top 0.152: RN6.7 22.82,22.55
  Top 0.2: U$49.C5 12.62,44.62 13.25,45.25 D12.9
  Bottom 0.125: RN5.6 22.85,22.55 v21.98,22.55
TC3  (via drill 0.3)
  Top 0.125: D12.7 D12.4 16.25,46.25 16.38,46.38 17.25,46.38 18,45.62 18,32.38 18.25,32.12 18.25,26.65 19.12,25.77 19.12,24.35 19.45,24.02 19.85,24.02 20.11,23.77 20.95,23.77 R43.1 21.88,23.57 v21.98,23.48 | RN6.6 22.05,23.4
  Top 0.152: 22.05,23.4 v21.98,23.48
  Top 0.2: U$49.C7 12.44,47.16 13.35,46.25 D12.7
  Bottom 0.125: RN5.7 22.05,23.4 v21.98,23.48
TC4  (via drill 0.3)
  Top 0.125: D12.6 D12.5 16.25,46.75 16.38,46.62 17.38,46.62 18.25,45.75 18.25,32.5 18.5,32.25 18.5,26.75 19.38,25.88 19.38,24.45 19.55,24.27 19.85,24.27 20.11,24.53 20.95,24.53 R43.2 21.57,24.73 v21.98,24.32 22.1,24.2 RN6.5
  Top 0.2: U$49.C8 13.57,46.75 D12.6
  Bottom 0.125: RN5.8 22.1,24.2 v21.98,24.32
TD1  (via drill 0.3)